# Altium schematic sheet Radio.SchDoc: Radio/Buzzer - Group 12
size A3; DrawnBy: William Johanson, Flynn Hill; Address1: ECE Department; Address2: University of Canterbury; Address3: Christchurch 8041; Address4: New Zealand; Revision: 1
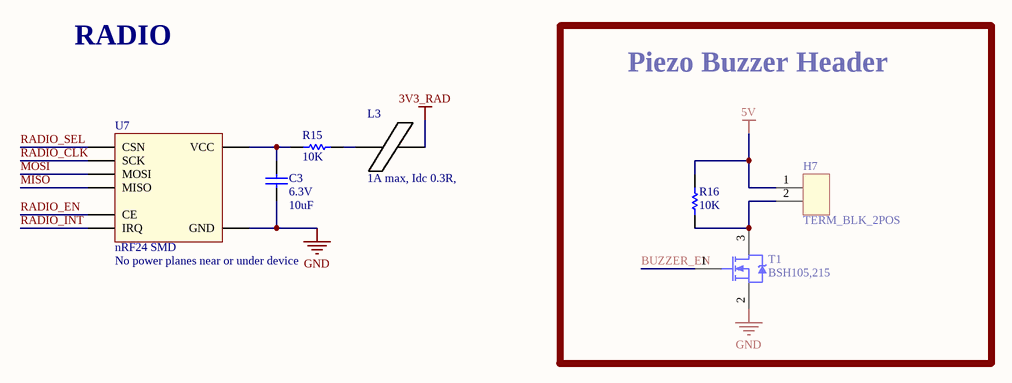
[diagram p0: Radio.SchDoc]

## Parts
C3  Voltage - Rated: 6.3V  [CAPC1608L]  (hidden comment: 10uF)
H7  TERM_BLK_2POS  [TERM_BLK_2POS]
L3  1A max, Idc 0.3R,  [INDC3216L]
R15  10K  [RESC1608L]
R16  10K  [RESC1608L]
T1  BSH105,215  [SOT23_L]
U7  nRF24 SMD  Warning: No power planes near or under device  [NRF24]

## Blocks framed on the sheet
Piezo Buzzer Header: H7 R16 T1

## Nets
3V3_RAD: L3.2
5V: H7.1 R16.2
GND: C3.1 T1.2 U7.2(GND)
BUZZER_EN: T1.1
MISO: U7.7(MISO)
MOSI: U7.6(MOSI)
RADIO_CLK: U7.5(SCK)
RADIO_EN: U7.3(CE)
RADIO_INT: U7.8(IRQ)
RADIO_SEL: U7.4(CSN)
NetC3_2: C3.2 R15.1 U7.1(VCC)
NetH7_2: H7.2 R16.1 T1.3
NetL3_1: L3.1 R15.2

## Notes on the sheet
- RADIO
- Title
- Drawn by:
- Date:
- Time:
- Revision:
- Sheet
- of
- File:

## Library data of the parts
C3 = CC_10uF_0603: CAP CER 10UF X5R +-20% 6V3 0603; Supplier: ECE Dept; Storage Location: PCB Assembly WS; Value: 10uF
H7 = TERM_BLK_2POS: 2 Position Terminal Block 7.62mm spacing
L3 = IN_Ferrite-Bead: Ferrite Bead, Rdc 0.3R, Z100MHZ 600R, Imax 1A, SMD 1206; Manufacturer: FAIR-RITE; Manufacturer PN: 2512066017Y1; DC Current Rating: 1; DC Resistance Max: 0.08; Ferrite Case Style: 1206 ^3216 Metric]; Frequency Range: 50MHz to 1; Impedance: 600; Impedance Tolerance: ± 25%; Supplier: ECE Dept; Storage Location: PCB Assembly WS; Ferrite Mounting: SMD; Supplier 1: Farnell; Supplier Part Number 1: 1612060; Manufacturer Part Number: 2512066017Y1; Value: 1A max, Idc 0.3R,
R15 R16 = RS_10K: RES 10.0K OHM 1/10W 5% 0603 SMD; Storage Location: PCB Assembly WS; Supplier: ECE Dept; Value: 10K
T1 = TM_BSH105: MOSFET N-CH 20V 1.05A SOT-23; Manufacturer: NXP Semiconductors; FET Type: MOSFET N-Channel, Metal Oxide; Gate Charge (Qg) @ Vgs: 3.9nC @ 4.5V; Input Capacitance (Ciss) @ Vds: 152pF @ 16V; Power - Max: 417mW; Rds On (Max) @ Id, Vgs: 200 mOhm @ 600mA, 4.5V; Supplier 1: Farnell; Supplier 2: Digi-Key; Current - Continuous Drain (Id) @ 25° C: 1.05A; Drain to Source Voltage (Vdss): 20V; Package / Case: TO-236-3, SC-59, SOT-23-3; Pricing: 1=0.53, 10=0.42, 25=0.3544, 100=0.2885, 250=0.23896, 500=0.1974, 1000=0.14785 (NZD); Supplier Part Number 1: 1758066; Supplier Part Number 2: 568-6215-1-ND; Storage Location: PCB Assembly WS; Supplier: ECE Dept; Manufacturer Part Number: BSH105,215
U7 = NRF24: nRF24 SMD Module